# Altium schematic sheet bob_breakout-top.SchDoc
size A4; SheetNumber: 1; SheetTotal: 8
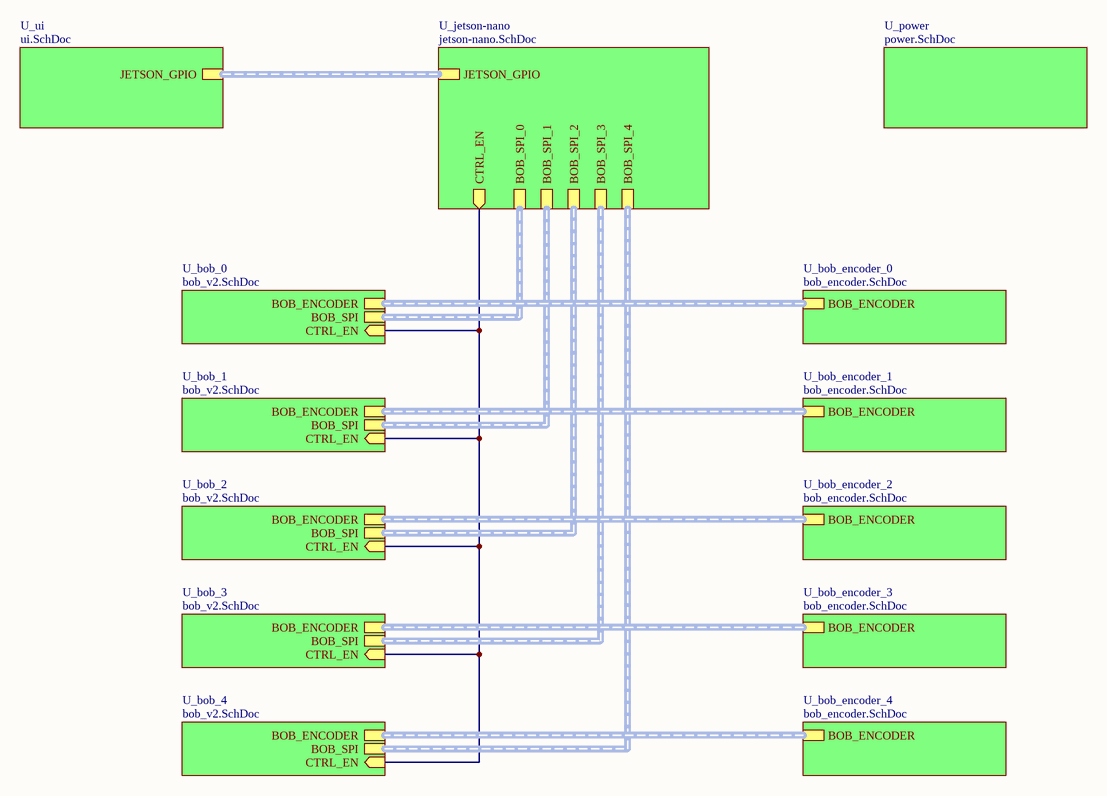
[diagram p0: bob_breakout-top.SchDoc]

## Sub-sheets
U_bob_0 = bob_v2.SchDoc: BOB_SPI (harness BOB_SPI), CTRL_EN (in), BOB_ENCODER
U_bob_1 = bob_v2.SchDoc: BOB_SPI (harness BOB_SPI), CTRL_EN (in), BOB_ENCODER
U_bob_2 = bob_v2.SchDoc: BOB_SPI (harness BOB_SPI), CTRL_EN (in), BOB_ENCODER
U_bob_3 = bob_v2.SchDoc: BOB_SPI (harness BOB_SPI), CTRL_EN (in), BOB_ENCODER
U_bob_4 = bob_v2.SchDoc: BOB_SPI (harness BOB_SPI), CTRL_EN (in), BOB_ENCODER
U_bob_encoder_0 = bob_encoder.SchDoc: BOB_ENCODER
U_bob_encoder_1 = bob_encoder.SchDoc: BOB_ENCODER
U_bob_encoder_2 = bob_encoder.SchDoc: BOB_ENCODER
U_bob_encoder_3 = bob_encoder.SchDoc: BOB_ENCODER
U_bob_encoder_4 = bob_encoder.SchDoc: BOB_ENCODER
U_jetson-nano = jetson-nano.SchDoc: BOB_SPI_2 (harness BOB_SPI), BOB_SPI_0 (harness BOB_SPI), BOB_SPI_4 (harness BOB_SPI), BOB_SPI_3 (harness BOB_SPI), BOB_SPI_1 (harness BOB_SPI), JETSON_GPIO (harness JETSON_GPIO), CTRL_EN (out)
U_power = power.SchDoc: no entries
U_ui = ui.SchDoc: JETSON_GPIO (harness JETSON_GPIO)

## Nets
(unnamed): sheet U_jetson-nano/CTRL_EN, sheet U_bob_0/CTRL_EN, sheet U_bob_1/CTRL_EN, sheet U_bob_2/CTRL_EN, sheet U_bob_3/CTRL_EN, sheet U_bob_4/CTRL_EN

## Buses and harness runs
harness sheet U_bob_0/BOB_ENCODER = sheet U_bob_encoder_0/BOB_ENCODER
harness sheet U_bob_0/BOB_SPI = sheet U_jetson-nano/BOB_SPI_0
harness sheet U_bob_1/BOB_ENCODER = sheet U_bob_encoder_1/BOB_ENCODER
harness sheet U_bob_1/BOB_SPI = sheet U_jetson-nano/BOB_SPI_1
harness sheet U_bob_2/BOB_ENCODER = sheet U_bob_encoder_2/BOB_ENCODER
harness sheet U_bob_2/BOB_SPI = sheet U_jetson-nano/BOB_SPI_2
harness sheet U_bob_3/BOB_ENCODER = sheet U_bob_encoder_3/BOB_ENCODER
harness sheet U_bob_3/BOB_SPI = sheet U_jetson-nano/BOB_SPI_3
harness sheet U_bob_4/BOB_ENCODER = sheet U_bob_encoder_4/BOB_ENCODER
harness sheet U_bob_4/BOB_SPI = sheet U_jetson-nano/BOB_SPI_4
harness sheet U_jetson-nano/JETSON_GPIO = sheet U_ui/JETSON_GPIO